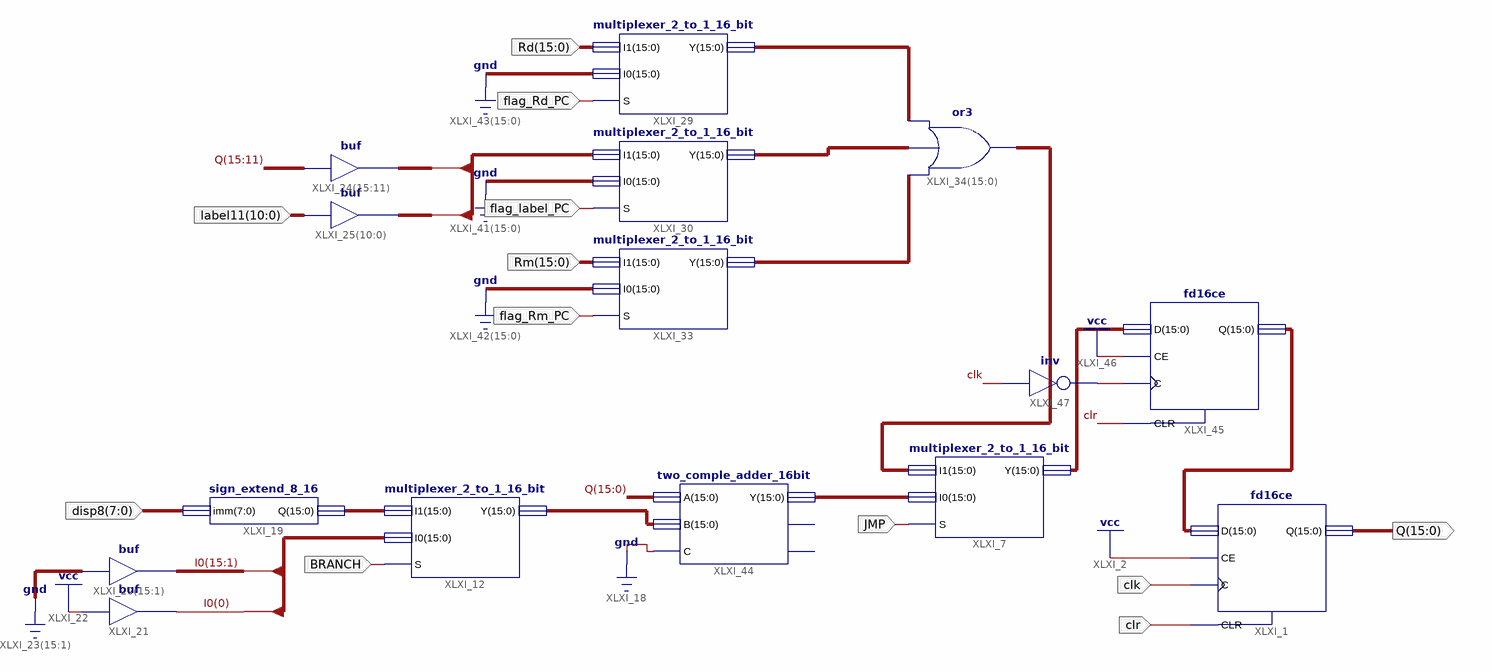
[diagram p0: schematic sheet 1]
// Xilinx ISE schematic PC_circuit.sch (virtex6) as structural Verilog: 15 symbols, 12 ports
module PC_circuit (
  input  clk,
  input  clr,
  input  [7:0] disp8,
  input  JMP,
  input  BRANCH,
  input  flag_Rd_PC,
  input  flag_label_PC,
  input  flag_Rm_PC,
  input  [10:0] label11,
  input  [15:0] Rd,
  input  [15:0] Rm,
  output [15:0] Q
);

  wire XLXN_79;
  wire [15:0] I0, label_PC, XLXN_4, XLXN_12, XLXN_22, XLXN_51, XLXN_52, XLXN_53, XLXN_62, XLXN_74, XLXN_77;

  fd16ce XLXI_1 (.C(clk), .CE(1'b1), .CLR(clr), .D(XLXN_77), .Q(Q));
  sign_extend_8_16 XLXI_19 (.imm(disp8), .Q(XLXN_4));
  assign I0[15:1] = {15{1'b0}};  // buf XLXI_20[15..1], 15 bits wide
  buf XLXI_21 (I0[0], 1'b1);
  multiplexer_2_to_1_16_bit XLXI_7 (.I0(XLXN_12), .I1(XLXN_62), .S(JMP), .Y(XLXN_74));
  multiplexer_2_to_1_16_bit XLXI_12 (.I0(I0), .I1(XLXN_4), .S(BRANCH), .Y(XLXN_22));
  multiplexer_2_to_1_16_bit XLXI_29 (.I0({16{1'b0}}), .I1(Rd), .S(flag_Rd_PC), .Y(XLXN_51));
  multiplexer_2_to_1_16_bit XLXI_30 (.I0({16{1'b0}}), .I1(label_PC), .S(flag_label_PC), .Y(XLXN_52));
  multiplexer_2_to_1_16_bit XLXI_33 (.I0({16{1'b0}}), .I1(Rm), .S(flag_Rm_PC), .Y(XLXN_53));
  assign XLXN_62 = XLXN_53 | XLXN_52 | XLXN_51;  // or3 XLXI_34[15..0], 16 bits wide
  assign label_PC[10:0] = label11;  // buf XLXI_25[10..0], 11 bits wide
  assign label_PC[15:11] = Q[15:11];  // buf XLXI_24[15..11], 5 bits wide
  two_comple_adder_16bit XLXI_44 (.A(Q), .B(XLXN_22), .C(1'b0), .Y(XLXN_12));  // open: Cout, Cout_1
  fd16ce XLXI_45 (.C(XLXN_79), .CE(1'b1), .CLR(clr), .D(XLXN_74), .Q(XLXN_77));
  not XLXI_47 (XLXN_79, clk);
endmodule
